# EAGLE design main (EAGLE 6.6.0)
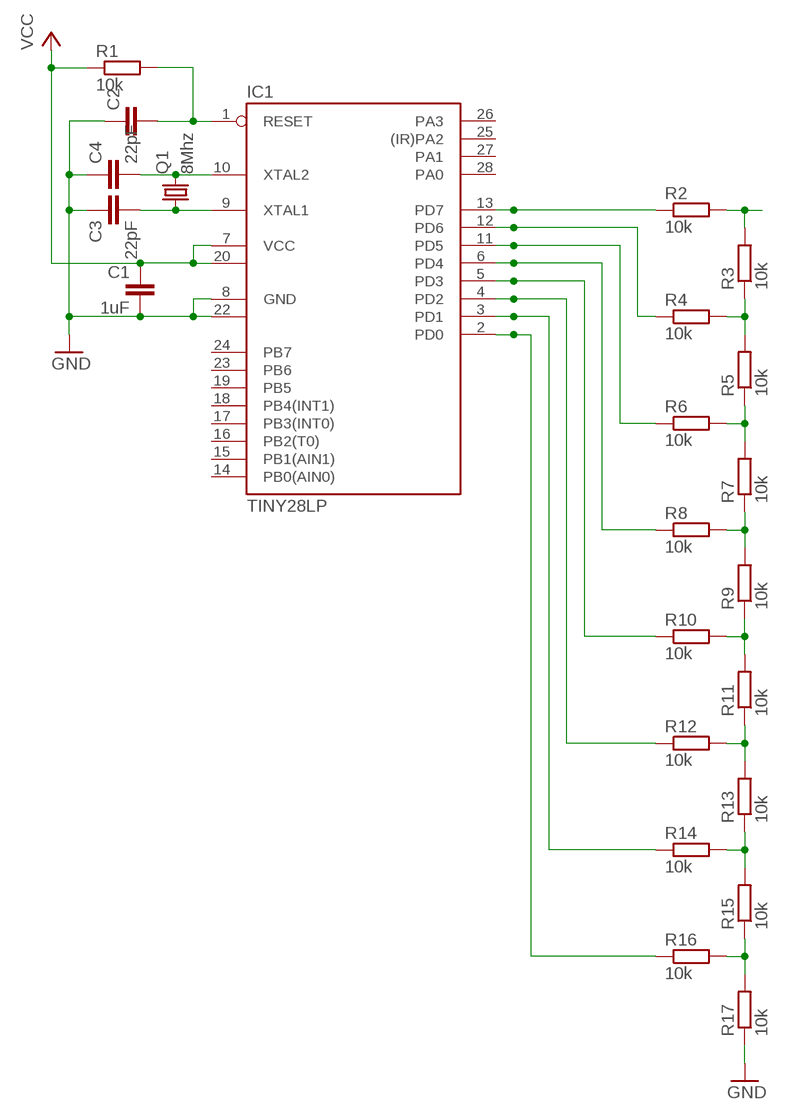
[diagram p0: schematic, sheet 1]

## Parts
C1  1uF  C-EUC1206  [C1206]
C2  C-EUC1206  [C1206]
C3  22pF  C-EUC1206  [C1206]
C4  22pF  C-EUC1206  [C1206]
IC1  TINY28LP  [DIL28-3]
Q1  8Mhz  CRYSTALHC49S  [HC49/S]
R1  10k  R-EU_R1206  [R1206]
R2  10k  R-EU_R1206  [R1206]
R3  10k  R-EU_R1206  [R1206]
R4  10k  R-EU_R1206  [R1206]
R5  10k  R-EU_R1206  [R1206]
R6  10k  R-EU_R1206  [R1206]
R7  10k  R-EU_R1206  [R1206]
R8  10k  R-EU_R1206  [R1206]
R9  10k  R-EU_R1206  [R1206]
R10  10k  R-EU_R1206  [R1206]
R11  10k  R-EU_R1206  [R1206]
R12  10k  R-EU_R1206  [R1206]
R13  10k  R-EU_R1206  [R1206]
R14  10k  R-EU_R1206  [R1206]
R15  10k  R-EU_R1206  [R1206]
R16  10k  R-EU_R1206  [R1206]
R17  10k  R-EU_R1206  [R1206]

## Nets
GND: C1.2 C2.1 C3.1 C4.1 IC1.8(GND) IC1.22(GND1) R17.1
N$1: C4.2 IC1.10(XTAL2) Q1.2
N$2: C3.2 IC1.9(XTAL1) Q1.1
N$3: R3.1 R4.2 R5.2
N$4: R2.2 R3.2
N$5: C2.2 IC1.1(RESET) R1.2
N$6: R5.1 R6.2 R7.2
N$7: R7.1 R8.2 R9.2
N$8: R11.1 R12.2 R13.2
N$9: R9.1 R10.2 R11.2
N$10: R13.1 R14.2 R15.2
N$11: R15.1 R16.2 R17.2
N$12: IC1.13(PD7) R2.1
N$13: IC1.12(PD6) R4.1
N$14: IC1.11(PD5) R6.1
N$15: IC1.6(PD4) R8.1
N$16: IC1.5(PD3) R10.1
N$17: IC1.4(PD2) R12.1
N$18: IC1.3(PD1) R14.1
N$19: IC1.2(PD0) R16.1
VCC: C1.1 IC1.7(VCC) IC1.20(VCC1) R1.1
Unconnected: IC1.14(PB0(AIN0)) IC1.15(PB1(AIN1)) IC1.16(PB2(T0)) IC1.17(PB3(INT0)) IC1.18(PB4(INT1)) IC1.19(PB5) IC1.21(NC1) IC1.23(PB6) IC1.24(PB7) IC1.25((IR)PA2) IC1.26(PA3) IC1.27(PA1) IC1.28(PA0)

## Library data of the parts
C1-C4 = rcl:C-EU: CAPACITOR, European symbol
IC1 = atmel:TINY28*P: MICROCONTROLLER 1.8 V 2 Kbytes FLASH; OC_FARNELL: unknown; OC_NEWARK: unknown
Q1 = crystal:CRYSTAL: CRYSTAL; OC_FARNELL: 1667008; OC_NEWARK: unknown
R1-R17 = rcl:R-EU_: RESISTOR, European symbol

## Board
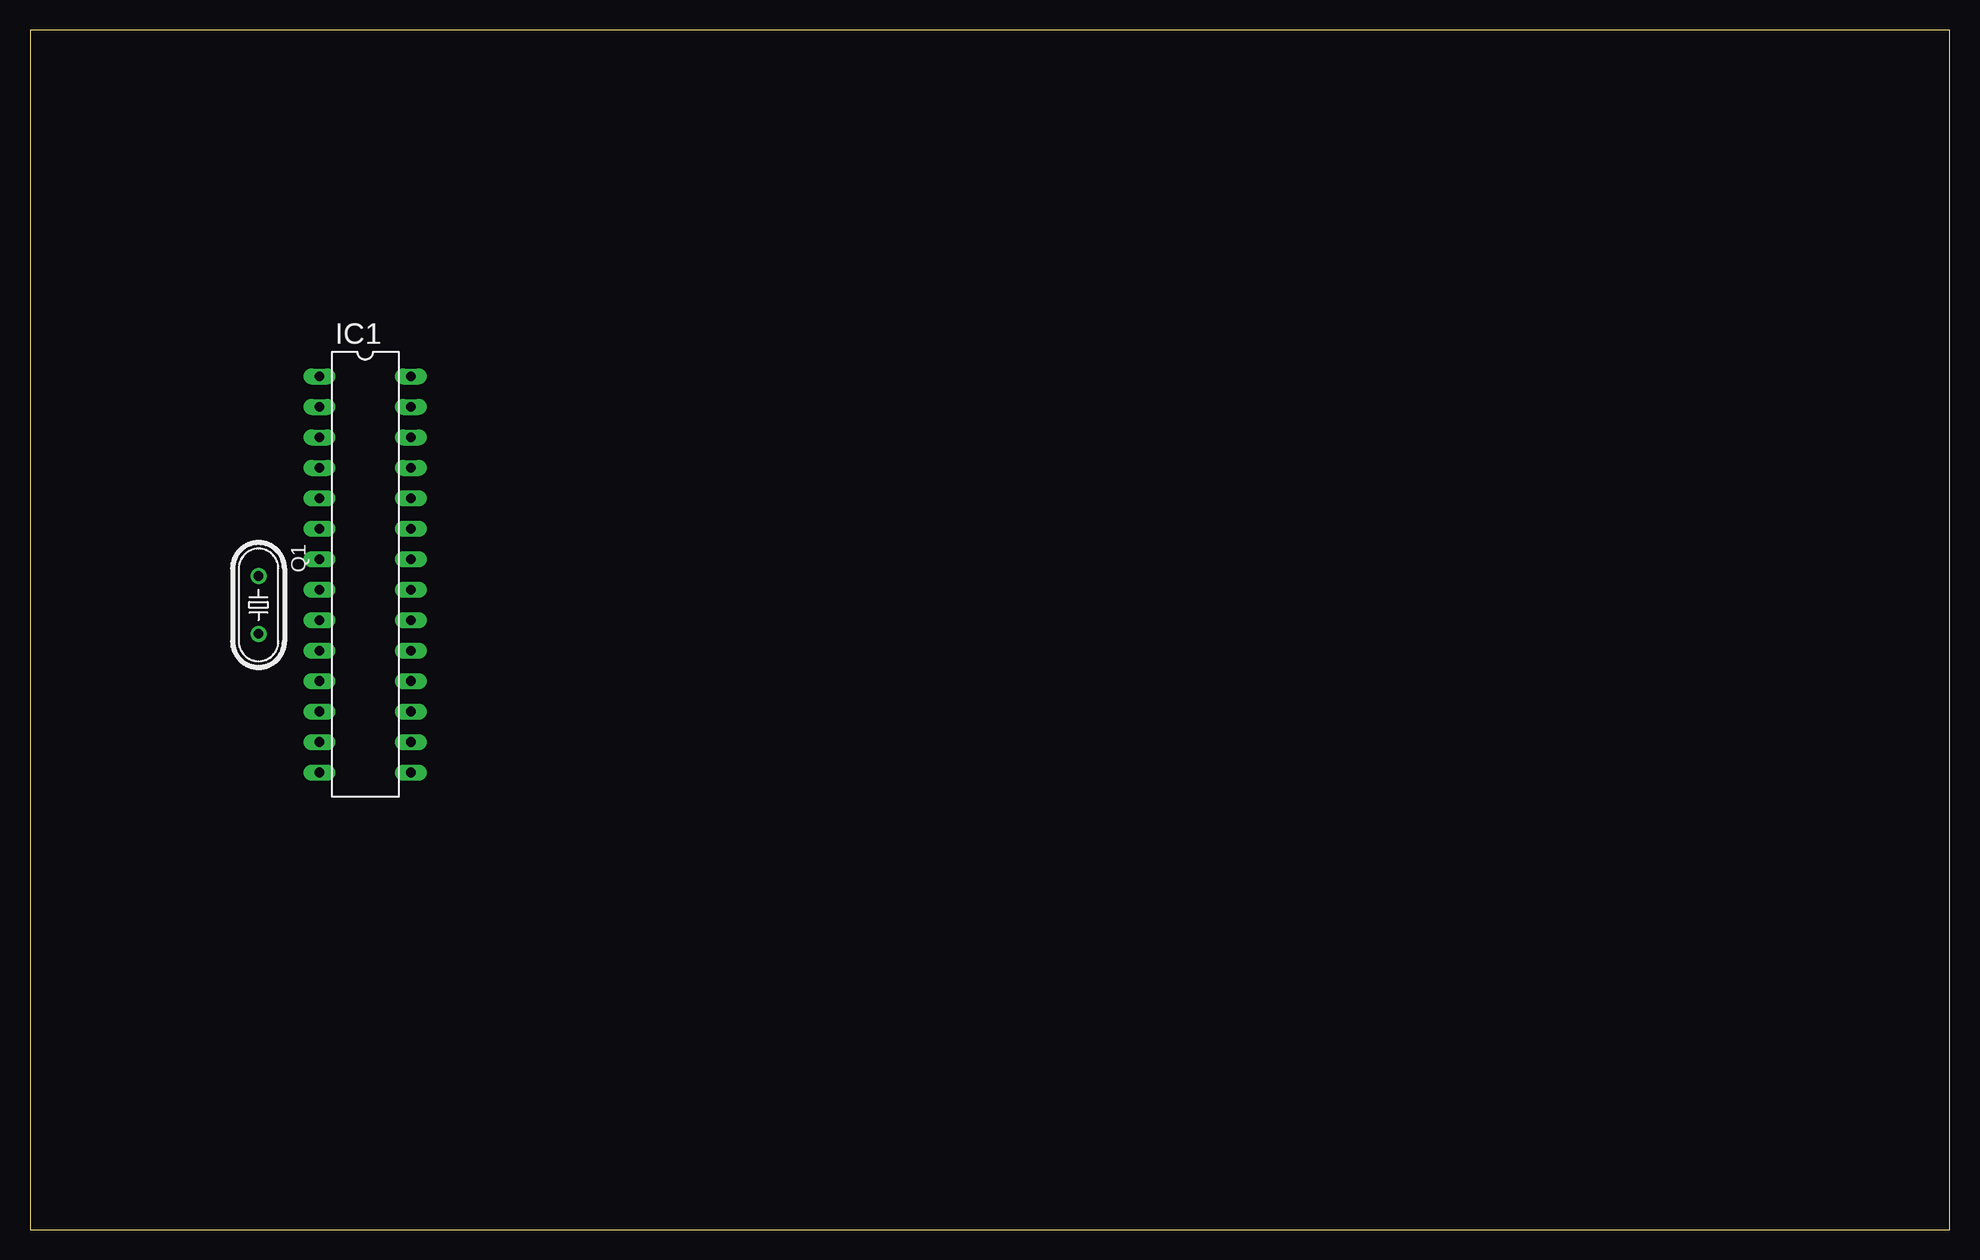
[diagram p1: board, top side]
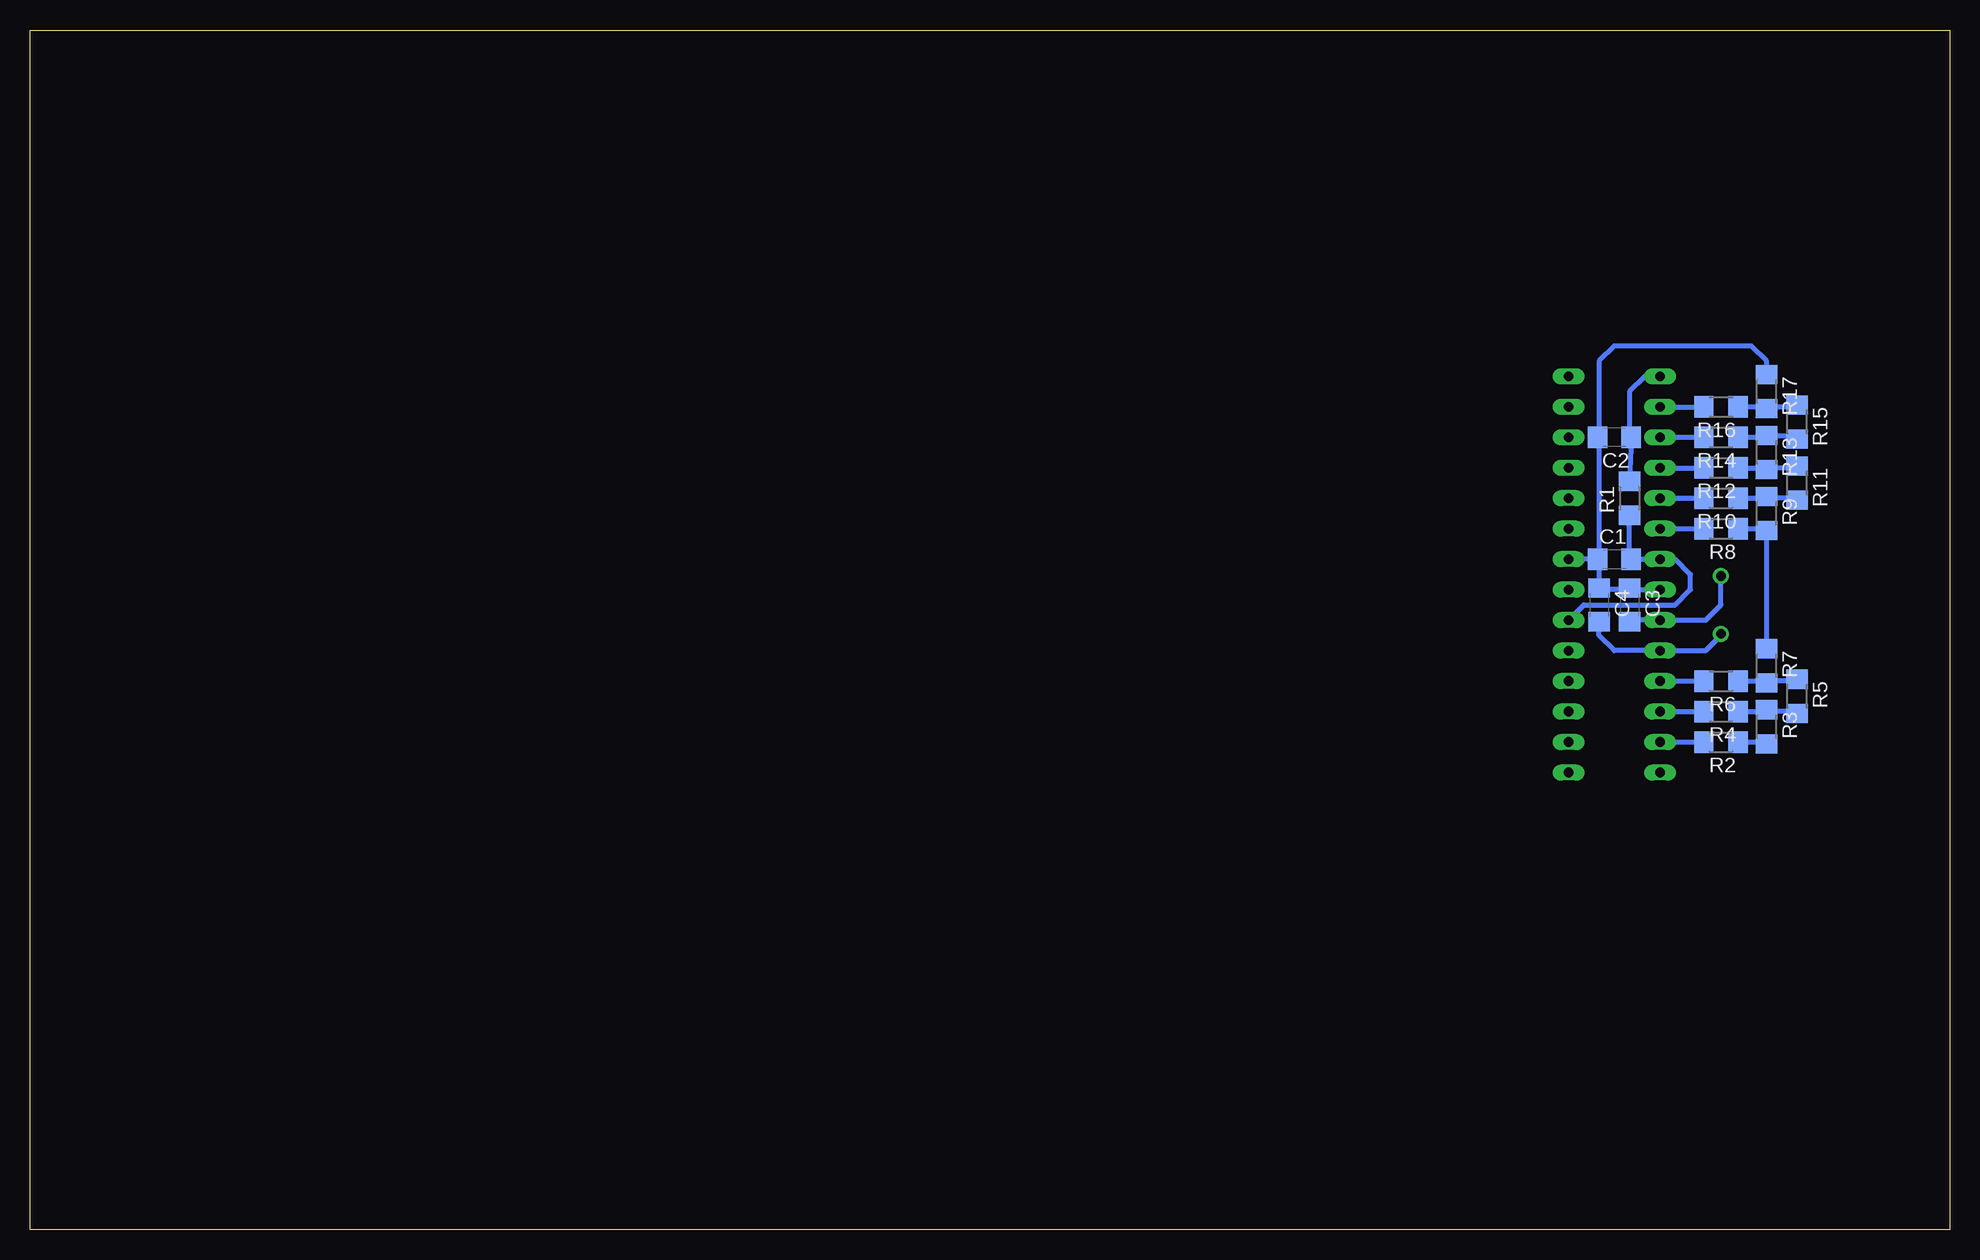
[diagram p2: board, bottom side, seen from below]

Size 160 x 100 mm. Coordinates in mm from the lower left corner, seen from the top.
Outline: 0,0 160,0 160,100 0,100 0,0
Copper layers (1*16): Top 0.035mm / dielectric 1.5mm / Bottom 0.035mm
Design rules "default": minimum track width 10mil, minimum drill 24mil, track to track 8mil, track to pad 8mil, pad to pad 8mil, via to via 8mil, smd to smd 8mil, copper to edge 40mil, drill to drill 8mil, minimum pad ring 10mil, minimum via ring 8mil, stop-mask expansion 4mil, vias tented up to drill 0mil, thermal gap 10mil

### Footprints (pad centres in the part's own frame; a part is rotated, then mirrored left to right if it is on the bottom)
C1206 = smd 1.6 x 1.8: 1 -1.4,0; 2 1.4,0
DIL28-3 = drill 0.813 long: 1 -16.51,-3.81; 2 -13.97,-3.81; 3 -11.43,-3.81; 4 -8.89,-3.81; 5 -6.35,-3.81; 6 -3.81,-3.81; 7 -1.27,-3.81; 8 1.27,-3.81; 9 3.81,-3.81; 10 6.35,-3.81; 11 8.89,-3.81; 12 11.43,-3.81; 13 13.97,-3.81; 14 16.51,-3.81; 15 16.51,3.81; 16 13.97,3.81; 17 11.43,3.81; 18 8.89,3.81; 19 6.35,3.81; 20 3.81,3.81; 21 1.27,3.81; 22 -1.27,3.81; 23 -3.81,3.81; 24 -6.35,3.81; 25 -8.89,3.81; 26 -11.43,3.81; 27 -13.97,3.81; 28 -16.51,3.81
HC49/S = drill 0.813: 1 -2.413,0; 2 2.413,0
R1206 = smd 1.6 x 1.803: 1 -1.422,0; 2 1.422,0

### Placement (x,y rotation side)
C1  27.94,55.88 0 bottom
C2  27.94,66.04 180 bottom
C3  26.67,52.07 270 bottom
C4  29.21,52.07 270 bottom
IC1  27.94,54.61 270 top
Q1  19.05,52.07 270 top
R1  26.67,60.96 90 bottom
R2  19.05,40.64 180 bottom
R3  15.24,41.91 270 bottom
R4  19.05,43.18 180 bottom
R5  12.7,44.45 270 bottom
R6  19.05,45.72 180 bottom
R7  15.24,46.99 270 bottom
R8  19.05,58.42 180 bottom
R9  15.24,59.69 270 bottom
R10  19.05,60.96 180 bottom
R11  12.7,62.23 270 bottom
R12  19.05,63.5 180 bottom
R13  15.24,64.77 270 bottom
R14  19.05,66.04 180 bottom
R15  12.7,67.31 270 bottom
R16  19.05,68.58 180 bottom
R17  15.24,69.85 270 bottom

### Tracks (layer width: path | path; a pad name or v marks a point on that pad's centre or on a via)
GND
  Bottom 0.406: 26.67,53.34 IC1.8 | C3.1 26.67,53.34 | 26.67,53.34 29.21,53.34 29.21,55.88 | 29.21,55.88 IC1.22 | R17.1 15.24,72.39 16.51,73.66 27.94,73.66 29.21,72.39 29.21,66.04 | 29.34,66.04 29.21,66.04 | 29.21,66.04 29.21,55.88
N$1
  Bottom 0.406: Q1.2 19.05,49.53 20.32,48.26 IC1.10 27.94,48.26 29.21,49.53 C4.2
N$2
  Bottom 0.406: Q1.1 19.05,52.07 20.32,50.8 IC1.9 26.67,50.8 C3.2
N$3
  Bottom 0.406: 17.63,43.18 15.24,43.18 | R5.2 12.7,43.18 15.24,43.18 | 15.24,43.18 R3.1
N$4
  Bottom 0.406: 17.63,40.64 15.24,40.64 R3.2
N$5
  Bottom 0.406: R1.2 26.54,66.04 26.67,66.04 26.67,69.85 25.4,71.12 IC1.1
N$6
  Bottom 0.406: 17.63,45.72 15.24,45.72 | R5.1 12.7,45.72 15.24,45.72 | 15.24,45.72 R7.2
N$7
  Bottom 0.406: 17.63,58.42 15.24,58.42 R7.1
N$8
  Bottom 0.406: 17.63,63.5 15.24,63.5 | 15.24,63.5 R13.2 | R11.1 12.7,63.5 15.24,63.5
N$9
  Bottom 0.406: R11.2 12.7,60.96 15.24,60.96 | 17.63,60.96 15.24,60.96 | 15.24,60.96 R9.1
N$10
  Bottom 0.406: 17.63,66.04 15.24,66.04 R13.1 12.7,66.19 R15.2
N$11
  Bottom 0.406: 15.24,68.58 17.63,68.58 | R15.1 12.7,68.58 15.24,68.58 | 15.24,68.58 R17.2
N$12
  Bottom 0.406: IC1.13 20.47,40.64
N$13
  Bottom 0.406: IC1.12 20.47,43.18
N$14
  Bottom 0.406: IC1.11 20.47,45.72
N$15
  Bottom 0.406: IC1.6 20.47,58.42
N$16
  Bottom 0.406: IC1.5 20.47,60.96
N$17
  Bottom 0.406: IC1.4 20.47,63.5
N$18
  Bottom 0.406: 20.47,66.04 IC1.3
N$19
  Bottom 0.406: IC1.2 20.47,68.58
VCC
  Bottom 0.406: IC1.20 30.48,52.07 22.86,52.07 21.59,53.34 21.59,54.61 22.86,55.88 IC1.7 26.67,55.88 R1.1